# EAGLE design r-2r (EAGLE 7.6.0)

## Sheet 1 of 2
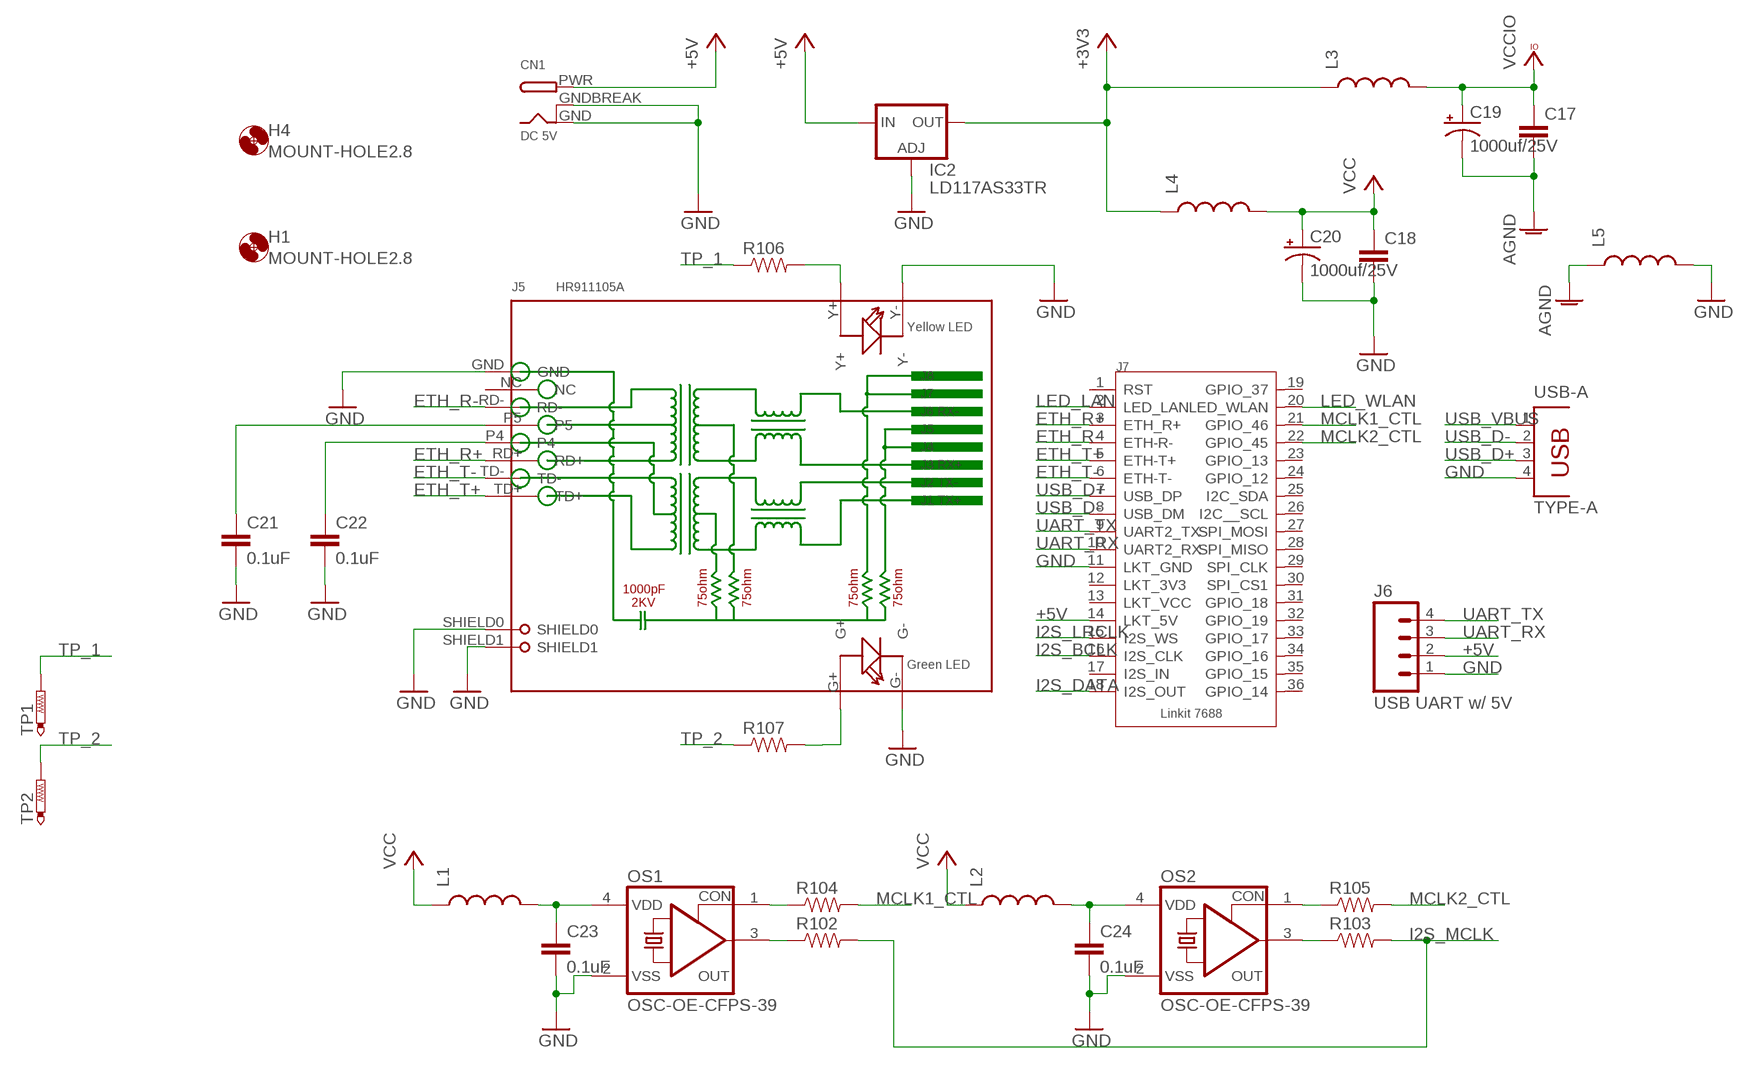
[diagram p0: schematic, sheet 1]

### Parts
C17  CAPPTH1  [CAP-PTH-5MM]
C18  CAPPTH1  [CAP-PTH-5MM]
C19  1000uf/25V  1000UF-25V(PTH)KIT  [CPOL-RADIAL-1000UF-25V-KIT]
C20  1000uf/25V  1000UF-25V(PTH)KIT  [CPOL-RADIAL-1000UF-25V-KIT]
C21  0.1uF  0.1UF-25V(+80/-20%)(0603)  [0603-CAP]
C22  0.1uF  0.1UF-25V(+80/-20%)(0603)  [0603-CAP]
C23  0.1uF  0.1UF-25V(+80/-20%)(0603)  [0603-CAP]
C24  0.1uF  0.1UF-25V(+80/-20%)(0603)  [0603-CAP]
CN1  DC 5V  DCBARRELPTH  [DCJACK_2MM_PTH]
H1  MOUNT-HOLE2.8  [2,8]
H4  MOUNT-HOLE2.8  [2,8]
IC2  LD117AS33TR  [SOT223]
J5  HR911105A  DIP-RJ45-CONNECTOR(HR911105A)  [RJ45-12+2P-21.3X16.04X13.4MM]
J6  USB UART w/ 5V  M04PTH  [1X04]
J7  LINKIT-7688  [LINKIT-7688-2X18]
L1  INDUCTOR0603  [0603]
L2  INDUCTOR0603  [0603]
L3  INDUCTORAXIAL-0.6  [AXIAL-0.6]
L4  INDUCTORAXIAL-0.6  [AXIAL-0.6]
L5  INDUCTOR0603  [0603]
OS1  OSC-OE-CFPS-39  [3.4X2.7-4-PAD]
OS2  OSC-OE-CFPS-39  [3.4X2.7-4-PAD]
R102  RESISTOR0603-RES  [0603-RES]
R103  RESISTOR0603-RES  [0603-RES]
R104  RESISTOR0603-RES  [0603-RES]
R105  RESISTOR0603-RES  [0603-RES]
R106  RESISTOR0603-RES  [0603-RES]
R107  RESISTOR0603-RES  [0603-RES]
TP1  PTR1PAD1-13  [P1-13]
TP2  PTR1PAD1-13  [P1-13]
USB-A  TYPE-A  PN87520  [PN87520]

### Nets
+3V3: IC2.4(OUT) L3.P$1 L4.P$1
+5V: CN1.PWR IC2.3(IN) J6.2 J7.14(LKT_5V)
AGND: C17.2 C19.- L5.1 ; also sheet 2
ETH_R+: J5.RD+ J7.3(ETH_R+)
ETH_R-: J5.RD- J7.4(ETH-R-)
ETH_T+: J5.TD+ J7.5(ETH-T+)
ETH_T-: J5.TD- J7.6(ETH-T-)
GND: C18.2 C20.- C21.2 C22.2 C23.2 C24.2 CN1.GND CN1.GNDBREAK IC2.1(ADJ) J5.G- J5.GND J5.SHIELD0 J5.SHIELD1 J5.Y- J6.1 J7.11(LKT_GND) L5.2 OS1.2(VSS) OS2.2(VSS) USB-A.4 ; also sheet 2
I2S_BCLK: J7.16(I2S_CLK) ; also sheet 2
I2S_DATA: J7.18(I2S_OUT) ; also sheet 2
I2S_LRCLK: J7.15(I2S_WS) ; also sheet 2
I2S_MCLK: R102.2 R103.2 ; also sheet 2
LED_LAN: J7.2(LED_LAN)
LED_WLAN: J7.20(LED_WLAN)
MCLK1_CTL: J7.21(GPIO_46) R104.2
MCLK2_CTL: J7.22(GPIO_45) R105.2
N$16: C24.1 L2.2 OS2.4(VDD)
N$39: OS2.3(OUT) R103.1
N$48: OS1.3(OUT) R102.1
N$55: OS1.1(CON) R104.1
N$56: OS2.1(CON) R105.1
N$57: C23.1 L1.2 OS1.4(VDD)
N$58: J5.G+ R107.2
N$60: J5.Y+ R106.2
N$67: C22.1 J5.P4
N$68: C21.1 J5.P5
TP_1: R106.1 TP1.TP
TP_2: R107.1 TP2.TP
UART_RX: J6.3 J7.10(UART2_RX)
UART_TX: J6.4 J7.9(UART2_TX)
USB_D+: J7.7(USB_DP) USB-A.3
USB_D-: J7.8(USB_DM) USB-A.2
USB_VBUS: USB-A.1
VCC: C18.1 C20.+ L1.1 L2.1 L4.P$2 ; also sheet 2
VCCIO: C17.1 C19.+ L3.P$2 ; also sheet 2
Unconnected: J5.NC J7.1(RST) J7.12(LKT_3V3) J7.13(LKT_VCC) J7.17(I2S_IN) J7.19(GPIO_37) J7.23(GPIO_13) J7.24(GPIO_12) J7.25(I2C_SDA) J7.26(I2C__SCL) J7.27(SPI_MOSI) J7.28(SPI_MISO) J7.29(SPI_CLK) J7.30(SPI_CS1) J7.31(GPIO_18) J7.32(GPIO_19) J7.33(GPIO_17) J7.34(GPIO_16) J7.35(GPIO_15) J7.36(GPIO_14)

## Sheet 2 of 2
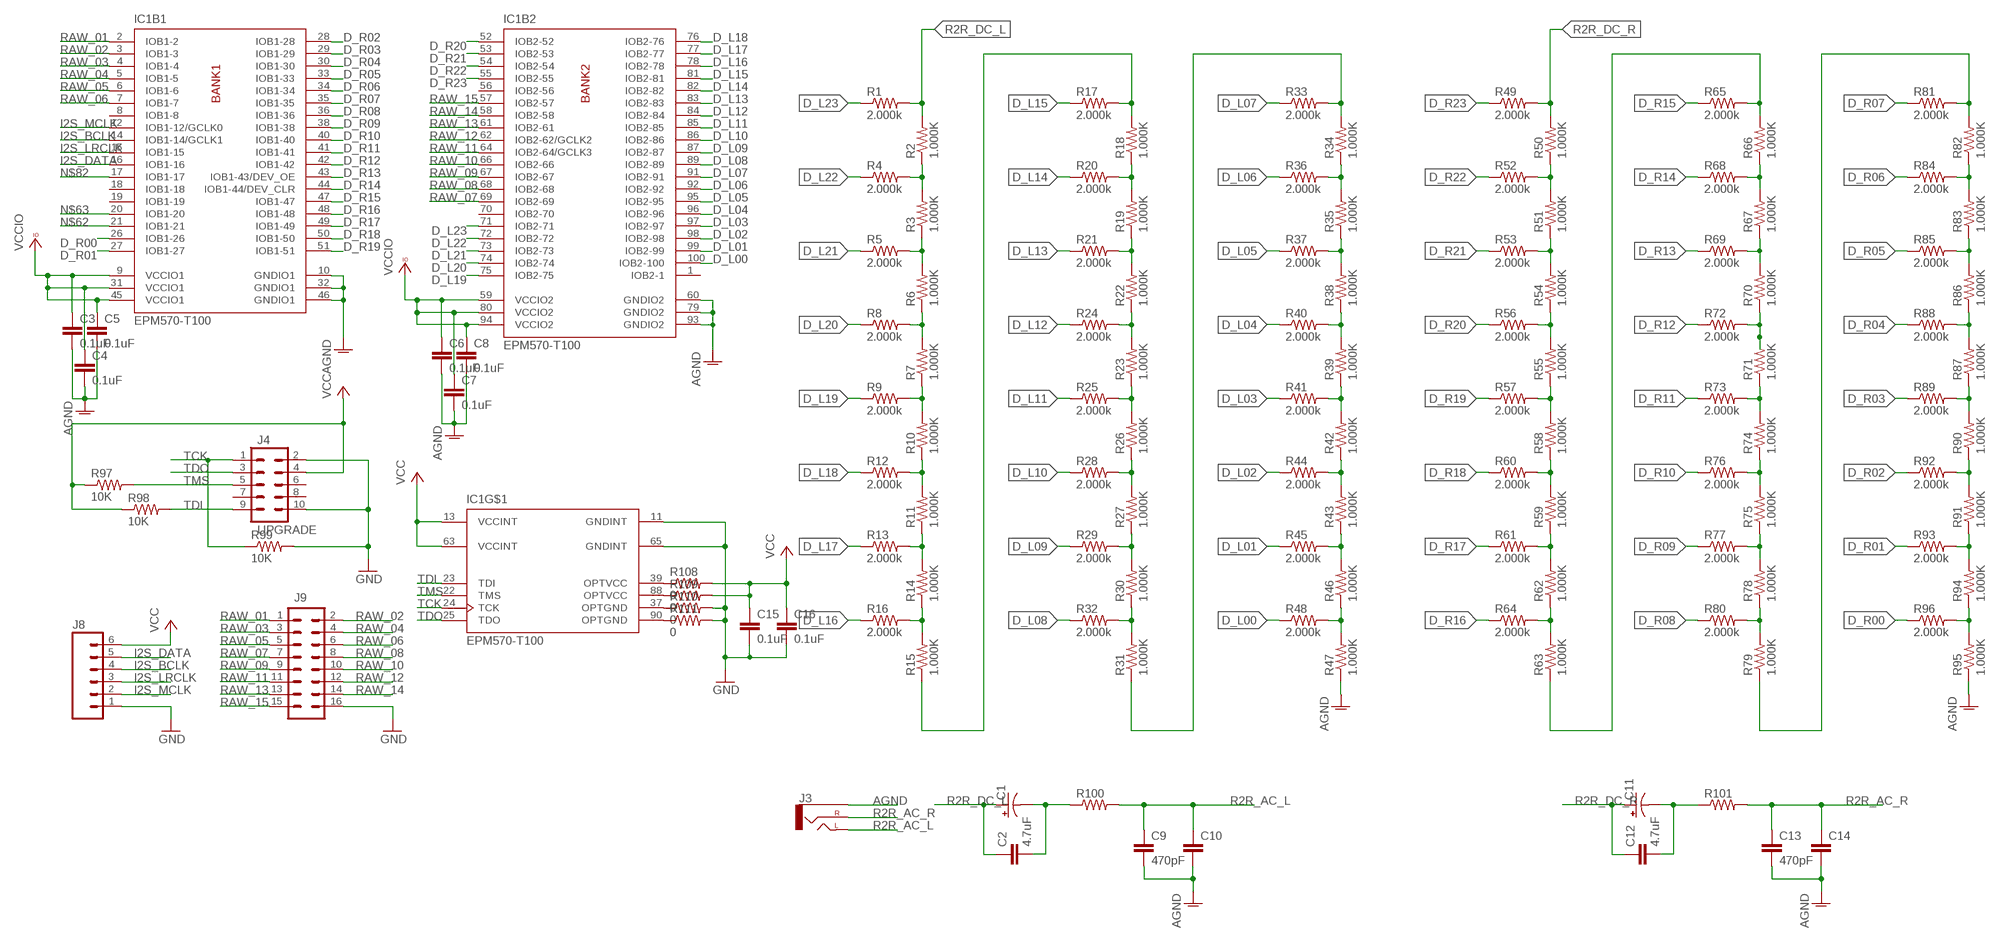
[diagram p1: schematic, sheet 2]

### Parts
C1  10UF-25V-20%(PTH)KIT  [CPOL-RADIAL-10UF-25V-KIT]
C2  4.7uF  4.7UF-16V-20%,+80%-(1206)  [1206-CAP]
C3  0.1uF  0.1UF-25V(+80/-20%)(0603)  [0603-CAP]
C4  0.1uF  0.1UF-25V(+80/-20%)(0603)  [0603-CAP]
C5  0.1uF  0.1UF-25V(+80/-20%)(0603)  [0603-CAP]
C6  0.1uF  0.1UF-25V(+80/-20%)(0603)  [0603-CAP]
C7  0.1uF  0.1UF-25V(+80/-20%)(0603)  [0603-CAP]
C8  0.1uF  0.1UF-25V(+80/-20%)(0603)  [0603-CAP]
C9  470pF  470PF-50V-5%(0603)SMD  [0603-CAP]
C10  CAPPTH1  [CAP-PTH-5MM]
C11  10UF-25V-20%(PTH)KIT  [CPOL-RADIAL-10UF-25V-KIT]
C12  4.7uF  4.7UF-16V-20%,+80%-(1206)  [1206-CAP]
C13  470pF  470PF-50V-5%(0603)SMD  [0603-CAP]
C14  CAPPTH1  [CAP-PTH-5MM]
C15  0.1uF  0.1UF-25V(+80/-20%)(0603)  [0603-CAP]
C16  0.1uF  0.1UF-25V(+80/-20%)(0603)  [0603-CAP]
IC1  EPM570-T100  [TQFP100]
J3  AUDIO-JACKSMD2  [AUDIO-JACK-3.5MM-SMD]
J4  UPGRADE  M05X2SHD  [2X5-SHROUDED]
J8  M06SILK_FEMALE_PTH  [1X06]
J9  M08X2  [2X8]
R1  2.000k  2.0KOHM1/10W5%(0603)  [0603-RES]
R2  1.000K  1KOHM-1/10W-1%(0603)  [0603-RES]
R3  1.000K  1KOHM-1/10W-1%(0603)  [0603-RES]
R4  2.000k  2.0KOHM1/10W5%(0603)  [0603-RES]
R5  2.000k  2.0KOHM1/10W5%(0603)  [0603-RES]
R6  1.000K  1KOHM-1/10W-1%(0603)  [0603-RES]
R7  1.000K  1KOHM-1/10W-1%(0603)  [0603-RES]
R8  2.000k  2.0KOHM1/10W5%(0603)  [0603-RES]
R9  2.000k  2.0KOHM1/10W5%(0603)  [0603-RES]
R10  1.000K  1KOHM-1/10W-1%(0603)  [0603-RES]
R11  1.000K  1KOHM-1/10W-1%(0603)  [0603-RES]
R12  2.000k  2.0KOHM1/10W5%(0603)  [0603-RES]
R13  2.000k  2.0KOHM1/10W5%(0603)  [0603-RES]
R14  1.000K  1KOHM-1/10W-1%(0603)  [0603-RES]
R15  1.000K  1KOHM-1/10W-1%(0603)  [0603-RES]
R16  2.000k  2.0KOHM1/10W5%(0603)  [0603-RES]
R17  2.000k  2.0KOHM1/10W5%(0603)  [0603-RES]
R18  1.000K  1KOHM-1/10W-1%(0603)  [0603-RES]
R19  1.000K  1KOHM-1/10W-1%(0603)  [0603-RES]
R20  2.000k  2.0KOHM1/10W5%(0603)  [0603-RES]
R21  2.000k  2.0KOHM1/10W5%(0603)  [0603-RES]
R22  1.000K  1KOHM-1/10W-1%(0603)  [0603-RES]
R23  1.000K  1KOHM-1/10W-1%(0603)  [0603-RES]
R24  2.000k  2.0KOHM1/10W5%(0603)  [0603-RES]
R25  2.000k  2.0KOHM1/10W5%(0603)  [0603-RES]
R26  1.000K  1KOHM-1/10W-1%(0603)  [0603-RES]
R27  1.000K  1KOHM-1/10W-1%(0603)  [0603-RES]
R28  2.000k  2.0KOHM1/10W5%(0603)  [0603-RES]
R29  2.000k  2.0KOHM1/10W5%(0603)  [0603-RES]
R30  1.000K  1KOHM-1/10W-1%(0603)  [0603-RES]
R31  1.000K  1KOHM-1/10W-1%(0603)  [0603-RES]
R32  2.000k  2.0KOHM1/10W5%(0603)  [0603-RES]
R33  2.000k  2.0KOHM1/10W5%(0603)  [0603-RES]
R34  1.000K  1KOHM-1/10W-1%(0603)  [0603-RES]
R35  1.000K  1KOHM-1/10W-1%(0603)  [0603-RES]
R36  2.000k  2.0KOHM1/10W5%(0603)  [0603-RES]
R37  2.000k  2.0KOHM1/10W5%(0603)  [0603-RES]
R38  1.000K  1KOHM-1/10W-1%(0603)  [0603-RES]
R39  1.000K  1KOHM-1/10W-1%(0603)  [0603-RES]
R40  2.000k  2.0KOHM1/10W5%(0603)  [0603-RES]
R41  2.000k  2.0KOHM1/10W5%(0603)  [0603-RES]
R42  1.000K  1KOHM-1/10W-1%(0603)  [0603-RES]
R43  1.000K  1KOHM-1/10W-1%(0603)  [0603-RES]
R44  2.000k  2.0KOHM1/10W5%(0603)  [0603-RES]
R45  2.000k  2.0KOHM1/10W5%(0603)  [0603-RES]
R46  1.000K  1KOHM-1/10W-1%(0603)  [0603-RES]
R47  1.000K  1KOHM-1/10W-1%(0603)  [0603-RES]
R48  2.000k  2.0KOHM1/10W5%(0603)  [0603-RES]
R49  2.000k  2.0KOHM1/10W5%(0603)  [0603-RES]
R50  1.000K  1KOHM-1/10W-1%(0603)  [0603-RES]
R51  1.000K  1KOHM-1/10W-1%(0603)  [0603-RES]
R52  2.000k  2.0KOHM1/10W5%(0603)  [0603-RES]
R53  2.000k  2.0KOHM1/10W5%(0603)  [0603-RES]
R54  1.000K  1KOHM-1/10W-1%(0603)  [0603-RES]
R55  1.000K  1KOHM-1/10W-1%(0603)  [0603-RES]
R56  2.000k  2.0KOHM1/10W5%(0603)  [0603-RES]
R57  2.000k  2.0KOHM1/10W5%(0603)  [0603-RES]
R58  1.000K  1KOHM-1/10W-1%(0603)  [0603-RES]
R59  1.000K  1KOHM-1/10W-1%(0603)  [0603-RES]
R60  2.000k  2.0KOHM1/10W5%(0603)  [0603-RES]
R61  2.000k  2.0KOHM1/10W5%(0603)  [0603-RES]
R62  1.000K  1KOHM-1/10W-1%(0603)  [0603-RES]
R63  1.000K  1KOHM-1/10W-1%(0603)  [0603-RES]
R64  2.000k  2.0KOHM1/10W5%(0603)  [0603-RES]
R65  2.000k  2.0KOHM1/10W5%(0603)  [0603-RES]
R66  1.000K  1KOHM-1/10W-1%(0603)  [0603-RES]
R67  1.000K  1KOHM-1/10W-1%(0603)  [0603-RES]
R68  2.000k  2.0KOHM1/10W5%(0603)  [0603-RES]
R69  2.000k  2.0KOHM1/10W5%(0603)  [0603-RES]
R70  1.000K  1KOHM-1/10W-1%(0603)  [0603-RES]
R71  1.000K  1KOHM-1/10W-1%(0603)  [0603-RES]
R72  2.000k  2.0KOHM1/10W5%(0603)  [0603-RES]
R73  2.000k  2.0KOHM1/10W5%(0603)  [0603-RES]
R74  1.000K  1KOHM-1/10W-1%(0603)  [0603-RES]
R75  1.000K  1KOHM-1/10W-1%(0603)  [0603-RES]
R76  2.000k  2.0KOHM1/10W5%(0603)  [0603-RES]
R77  2.000k  2.0KOHM1/10W5%(0603)  [0603-RES]
R78  1.000K  1KOHM-1/10W-1%(0603)  [0603-RES]
R79  1.000K  1KOHM-1/10W-1%(0603)  [0603-RES]
R80  2.000k  2.0KOHM1/10W5%(0603)  [0603-RES]
R81  2.000k  2.0KOHM1/10W5%(0603)  [0603-RES]
R82  1.000K  1KOHM-1/10W-1%(0603)  [0603-RES]
R83  1.000K  1KOHM-1/10W-1%(0603)  [0603-RES]
R84  2.000k  2.0KOHM1/10W5%(0603)  [0603-RES]
R85  2.000k  2.0KOHM1/10W5%(0603)  [0603-RES]
R86  1.000K  1KOHM-1/10W-1%(0603)  [0603-RES]
R87  1.000K  1KOHM-1/10W-1%(0603)  [0603-RES]
R88  2.000k  2.0KOHM1/10W5%(0603)  [0603-RES]
R89  2.000k  2.0KOHM1/10W5%(0603)  [0603-RES]
R90  1.000K  1KOHM-1/10W-1%(0603)  [0603-RES]
R91  1.000K  1KOHM-1/10W-1%(0603)  [0603-RES]
R92  2.000k  2.0KOHM1/10W5%(0603)  [0603-RES]
R93  2.000k  2.0KOHM1/10W5%(0603)  [0603-RES]
R94  1.000K  1KOHM-1/10W-1%(0603)  [0603-RES]
R95  1.000K  1KOHM-1/10W-1%(0603)  [0603-RES]
R96  2.000k  2.0KOHM1/10W5%(0603)  [0603-RES]
R97  10K  10OHM-1/10W-5%0603SMD  [0603-RES]
R98  10K  10OHM-1/10W-5%0603SMD  [0603-RES]
R99  10K  10OHM-1/10W-5%0603SMD  [0603-RES]
R100  RESISTOR1206  [1206]
R101  RESISTOR1206  [1206]
R108  0  0OHM-1/10W-5%(0603)  [0603]
R109  0  0OHM-1/10W-5%(0603)  [0603]
R110  0  0OHM-1/10W-5%(0603)  [0603]
R111  0  0OHM-1/10W-5%(0603)  [0603]

### Nets
AGND: C3.2 C4.2 C5.2 C6.2 C7.2 C8.2 C9.2 C10.2 C13.2 C14.2 IC1.10(B1:GNDIO1) IC1.32(B1:GNDIO1) IC1.46(B1:GNDIO1) IC1.60(B2:GNDIO2) IC1.79(B2:GNDIO2) IC1.93(B2:GNDIO2) J3.SLEEVE R47.1 R95.1 ; also sheet 1
D_L00: IC1.100(B2:IOB2-100) R48.1
D_L01: IC1.99(B2:IOB2-99) R45.1
D_L02: IC1.98(B2:IOB2-98) R44.1
D_L03: IC1.97(B2:IOB2-97) R41.1
D_L04: IC1.96(B2:IOB2-96) R40.1
D_L05: IC1.95(B2:IOB2-95) R37.1
D_L06: IC1.92(B2:IOB2-92) R36.1
D_L07: IC1.91(B2:IOB2-91) R33.1
D_L08: IC1.89(B2:IOB2-89) R32.1
D_L09: IC1.87(B2:IOB2-87) R29.1
D_L10: IC1.86(B2:IOB2-86) R28.1
D_L11: IC1.85(B2:IOB2-85) R25.1
D_L12: IC1.84(B2:IOB2-84) R24.1
D_L13: IC1.83(B2:IOB2-83) R21.1
D_L14: IC1.82(B2:IOB2-82) R20.1
D_L15: IC1.81(B2:IOB2-81) R17.1
D_L16: IC1.78(B2:IOB2-78) R16.1
D_L17: IC1.77(B2:IOB2-77) R13.1
D_L18: IC1.76(B2:IOB2-76) R12.1
D_L19: IC1.75(B2:IOB2-75) R9.1
D_L20: IC1.74(B2:IOB2-74) R8.1
D_L21: IC1.73(B2:IOB2-73) R5.1
D_L22: IC1.72(B2:IOB2-72) R4.1
D_L23: IC1.71(B2:IOB2-71) R1.1
D_R00: IC1.26(B1:IOB1-26) R96.1
D_R01: IC1.27(B1:IOB1-27) R93.1
D_R02: IC1.28(B1:IOB1-28) R92.1
D_R03: IC1.29(B1:IOB1-29) R89.1
D_R04: IC1.30(B1:IOB1-30) R88.1
D_R05: IC1.33(B1:IOB1-33) R85.1
D_R06: IC1.34(B1:IOB1-34) R84.1
D_R07: IC1.35(B1:IOB1-35) R81.1
D_R08: IC1.36(B1:IOB1-36) R80.1
D_R09: IC1.38(B1:IOB1-38) R77.1
D_R10: IC1.40(B1:IOB1-40) R76.1
D_R11: IC1.41(B1:IOB1-41) R73.1
D_R12: IC1.42(B1:IOB1-42) R72.1
D_R13: IC1.43(B1:IOB1-43/DEV_OE) R69.1
D_R14: IC1.44(B1:IOB1-44/DEV_CLR) R68.1
D_R15: IC1.47(B1:IOB1-47) R65.1
D_R16: IC1.48(B1:IOB1-48) R64.1
D_R17: IC1.49(B1:IOB1-49) R61.1
D_R18: IC1.50(B1:IOB1-50) R60.1
D_R19: IC1.51(B1:IOB1-51) R57.1
D_R20: IC1.52(B2:IOB2-52) R56.1
D_R21: IC1.53(B2:IOB2-53) R53.1
D_R22: IC1.54(B2:IOB2-54) R52.1
D_R23: IC1.55(B2:IOB2-55) R49.1
GND: C15.2 C16.2 IC1.11(GNDINT) IC1.65(GNDINT) J4.2 J4.10 J8.1 J9.16 R99.2 R110.2 R111.2 ; also sheet 1
I2S_BCLK: IC1.14(B1:IOB1-14/GCLK1) J8.4 ; also sheet 1
I2S_DATA: IC1.16(B1:IOB1-16) J8.5 ; also sheet 1
I2S_LRCLK: IC1.15(B1:IOB1-15) J8.3 ; also sheet 1
I2S_MCLK: IC1.12(B1:IOB1-12/GCLK0) J8.2 ; also sheet 1
N$1: R7.1 R9.2 R10.2
N$2: R2.1 R3.2 R4.2
N$3: R3.1 R5.2 R6.2
N$4: R6.1 R7.2 R8.2
N$5: C1.2(-) C2.2 R100.1
N$6: R10.1 R11.2 R12.2
N$7: R11.1 R13.2 R14.2
N$8: R14.1 R15.2 R16.2
N$9: R15.1 R17.2 R18.2
N$10: R31.1 R33.2 R34.2
N$11: R79.1 R81.2 R82.2
N$12: R63.1 R65.2 R66.2
N$13: IC1.39(OPTVCC) R108.1
N$14: R18.1 R19.2 R20.2
N$15: R19.1 R21.2 R22.2
N$17: R46.1 R47.2 R48.2
N$18: R43.1 R45.2 R46.2
N$19: R34.1 R35.2 R36.2
N$20: R35.1 R37.2 R38.2
N$21: R38.1 R39.2 R40.2
N$22: R39.1 R41.2 R42.2
N$23: R42.1 R43.2 R44.2
N$24: R66.1 R67.2 R68.2
N$25: R67.1 R69.2 R70.2
N$26: R70.1 R71.2 R72.2
N$27: R71.1 R73.2 R74.2
N$28: R74.1 R75.2 R76.2
N$29: R75.1 R77.2 R78.2
N$30: R78.1 R79.2 R80.2
N$31: R82.1 R83.2 R84.2
N$32: R83.1 R85.2 R86.2
N$33: R86.1 R87.2 R88.2
N$34: R87.1 R89.2 R90.2
N$35: R90.1 R91.2 R92.2
N$36: R91.1 R93.2 R94.2
N$37: R94.1 R95.2 R96.2
N$38: C11.2(-) C12.2 R101.1
N$40: R22.1 R23.2 R24.2
N$41: R23.1 R25.2 R26.2
N$42: R26.1 R27.2 R28.2
N$43: R27.1 R29.2 R30.2
N$44: R30.1 R31.2 R32.2
N$45: R50.1 R51.2 R52.2
N$46: R51.1 R53.2 R54.2
N$47: R54.1 R55.2 R56.2
N$49: R55.1 R57.2 R58.2
N$50: R58.1 R59.2 R60.2
N$51: R59.1 R61.2 R62.2
N$52: R62.1 R63.2 R64.2
N$53: IC1.88(OPTVCC) R109.1
N$59: IC1.37(OPTGND) R110.1
N$61: IC1.90(OPTGND) R111.1
N$62: IC1.21(B1:IOB1-21)
N$63: IC1.20(B1:IOB1-20)
N$82: IC1.17(B1:IOB1-17)
R2R_AC_L: C9.1 C10.1 J3.TIP(LEFT) R100.2
R2R_AC_R: C13.1 C14.1 J3.RING(RIGHT) R101.2
R2R_DC_L: C1.1(+) C2.1 R1.2 R2.2
R2R_DC_R: C11.1(+) C12.1 R49.2 R50.2
RAW_01: IC1.2(B1:IOB1-2) J9.1
RAW_02: IC1.3(B1:IOB1-3) J9.2
RAW_03: IC1.4(B1:IOB1-4) J9.3
RAW_04: IC1.5(B1:IOB1-5) J9.4
RAW_05: IC1.6(B1:IOB1-6) J9.5
RAW_06: IC1.7(B1:IOB1-7) J9.6
RAW_07: IC1.69(B2:IOB2-69) J9.7
RAW_08: IC1.68(B2:IOB2-68) J9.8
RAW_09: IC1.67(B2:IOB2-67) J9.9
RAW_10: IC1.66(B2:IOB2-66) J9.10
RAW_11: IC1.64(B2:IOB2-64/GCLK3) J9.11
RAW_12: IC1.62(B2:IOB2-62/GCLK2) J9.12
RAW_13: IC1.61(B2:IOB2-61) J9.13
RAW_14: IC1.58(B2:IOB2-58) J9.14
RAW_15: IC1.57(B2:IOB2-57) J9.15
TCK: IC1.24(TCK) J4.1 R99.1
TDI: IC1.23(TDI) J4.9 R98.2
TDO: IC1.25(TDO) J4.3
TMS: IC1.22(TMS) J4.5 R97.2
VCC: C15.1 C16.1 IC1.13(VCCINT) IC1.63(VCCINT) J4.4 J8.6 R97.1 R98.1 R108.2 R109.2 ; also sheet 1
VCCIO: C3.1 C4.1 C5.1 C6.1 C7.1 C8.1 IC1.9(B1:VCCIO1) IC1.31(B1:VCCIO1) IC1.45(B1:VCCIO1) IC1.59(B2:VCCIO2) IC1.80(B2:VCCIO2) IC1.94(B2:VCCIO2) ; also sheet 1
Unconnected: IC1.1(B2:IOB2-1) IC1.8(B1:IOB1-8) IC1.18(B1:IOB1-18) IC1.19(B1:IOB1-19) IC1.56(B2:IOB2-56) IC1.70(B2:IOB2-70) J4.6 J4.7 J4.8

## Library data of the parts
C1 C11 = SparkFun-Capacitors:10UF-25V-20%(PTH): CAP-08440; PROD_ID: CAP-08440
C2 C12 = SparkFun-Capacitors:4.7UF-16V-20%,+80%-(1206): CAP-10300; PROD_ID: CAP-10300
C3-C8 C15 C16 C21-C24 = SparkFun-Capacitors:0.1UF-25V(+80/-20%)(0603): CAP-00810 Ceramic Standard decoupling cap; PROD_ID: CAP-00810
C9 C13 = SparkFun-Capacitors:470PF-50V-5%(0603): CAP-07884; PROD_ID: CAP-07884
C10 C14 C17 C18 = SparkFun-Capacitors:CAP: Capacitor Standard 0603 ceramic capacitor, and 0.1" leaded capacitor.
C19 C20 = SparkFun-Capacitors:1000UF-25V(PTH): CAP-08070; PROD_ID: CAP-09538
CN1 = adafruit:DCBARREL: 2.0mm DC Barrel Jack DCJACK_2MM_PTH - Through Hole Jack (4UConnector: 05537)
H1 H4 = holes:MOUNT-HOLE: MOUNTING HOLE with drill center marker
IC1 = noel-altera-max2:EPM570-T100: Altera MAX II CPLD - EPM570 TQFP-100 Device EPM570 from Altera MAX II Family Feature EPM570 LEs 570 Typical Equivalent Macrocells 440 Equivalent Macrocell Range 240 ... 570 UFM Size (bits) 8192 User I/O pins 76 tPD1 (ns) 5.4 fCNT (MHz) 304 tSU (ns) 1.2 tCO (ns) 4.5
IC2 = v-reg:LD117A?*: Low drop fixed and adjustable positive voltage regulators 1 A Source: http://www.st.com/stonline/products/literature/ds/7194/ld1117axx.pdf
J3 = SparkFun-Connectors:AUDIO-JACK: 3.5mm Audio Jack Simple 3.5mm common PCB mount audio jack. Variant PTH is our storefront SKU PRT-08032; PROD_ID: CONN-10353
J4 = SparkFun-Connectors:M05X2: Header 5x2 Standard 10-pin dual row 0.1" header. Commonly used with AVR-ISP. Use with Spark Fun Electronics SKU: PRT-00778
J5 = Seeed-OPL-Connector:DIP-RJ45-CONNECTOR(HR911105A): 320140005; MPN: HR911105A
J6 = SparkFun-Connectors:M04: Header 4 Standard 4-pin 0.1" header. Use with straight break away headers (SKU : PRT-00116), right angle break away headers (PRT-00553), swiss pins (PRT-00743), machine pins (PRT-00117), and female headers (PRT-00115). Molex polarized connector foot print use with SKU : PRT-08231 with associated crimp pins and housings. 1MM SMD Version SKU: PRT-10208; PROD_ID: CONN-09696
J7 = linkit7688:LINKIT-7688
J8 = SparkFun-Connectors:M06: Header 6 Standard 6-pin 0.1" header. Use with straight break away headers (SKU : PRT-00116), right angle break away headers (PRT-00553), swiss pins (PRT-00743), machine pins (PRT-00117), and female headers (PRT-00115). Molex polarized connector foot print use with SKU : PRT-08094 with associated crimp pins and housings. NOTES ON THE VARIANTS LOCK and LOCK_LONGPADS... This footprint was designed to help hold the alignment of a through-hole component (i.e. 6-pin header) while soldering it into place. You may notice that each hole has been shifted either up or down by 0.005 of an inch from it's more standard position (which is a perfectly straight line). This slight alteration caused the pins (the squares in the middle) to touch the edges of the holes. Because they are alternating, it causes a "brace" to hold the component in place. 0.005 has proven to be the perfect amount of "off-center" position when using our standard breakaway headers. Although looks a little odd when you look at the bare footprint, once you have a header in there, the alteration is very hard to notice. Also,if you push a header all the way into place, it is covered up entirely on the bottom side. This idea of altering the position of holes to aid alignment will be further integrated into the Sparkfun Library for other footprints. It can help hold any component with 3 or more connection pins.; PROD_ID: CONN-08437
J9 = SparkFun-Connectors:M08X2: .1" headers, two rows of 8 each
L1-L5 = SparkFun-Passives:INDUCTOR: Inductors Basic Inductor/Choke - 0603 and 1206. Footprints are not proven and vary greatly between part numbers. INDUCTOR POWER 3.3UH 4.0A SMD 0.197" L x 0.197" W x 0.177" H (5.00mm x 5.00mm x 4.50mm)
OS1 OS2 = IQD-Frequency-Products:OSC-OE: OSCILLATOR WITH OE
R1 R4 R5 R8 R9 R12 R13 R16 R17 R20 R21 R24 R25 R28 R29 R32 R33 R36 R37 R40 R41 R44 R45 R48 R49 R52 R53 R56 R57 R60 R61 R64 R65 R68 R69 R72 R73 R76 R77 R80 R81 R84 R85 R88 R89 R92 R93 R96 = SparkFun-Resistors:2.0KOHM1/10W5%(0603): RES-08296; PROD_ID: RES-08296; VALUE: 2.0k
R2 R3 R6 R7 R10 R11 R14 R15 R18 R19 R22 R23 R26 R27 R30 R31 R34 R35 R38 R39 R42 R43 R46 R47 R50 R51 R54 R55 R58 R59 R62 R63 R66 R67 R70 R71 R74 R75 R78 R79 R82 R83 R86 R87 R90 R91 R94 R95 = SparkFun-Resistors:1KOHM-1/10W-1%(0603): RES-07856; PROD_ID: RES-07856; VALUE: 1K
R97-R99 = SparkFun-Resistors:10OHM-1/10W-5%0603: RES-09834; PROD_ID: RES-09834; VALUE: 10
R100 R101 = SparkFun-Resistors:RESISTOR: Resistor Basic schematic elements and footprints for 0603, 1206, and PTH resistors.
R102-R107 = SparkFun-Passives:RESISTOR: Resistor Basic schematic elements and footprints for 0603, 1206, and PTH resistors.
R108-R111 = SparkFun-Resistors:0OHM-1/10W-5%(0603): RES-08609; PROD_ID: RES-08609
TP1 TP2 = testpad:PTR1: TEST PIN
USB-A = con-berg:PN87520: BERG USB connector; OC_FARNELL: unknown; OC_NEWARK: unknown

## Board
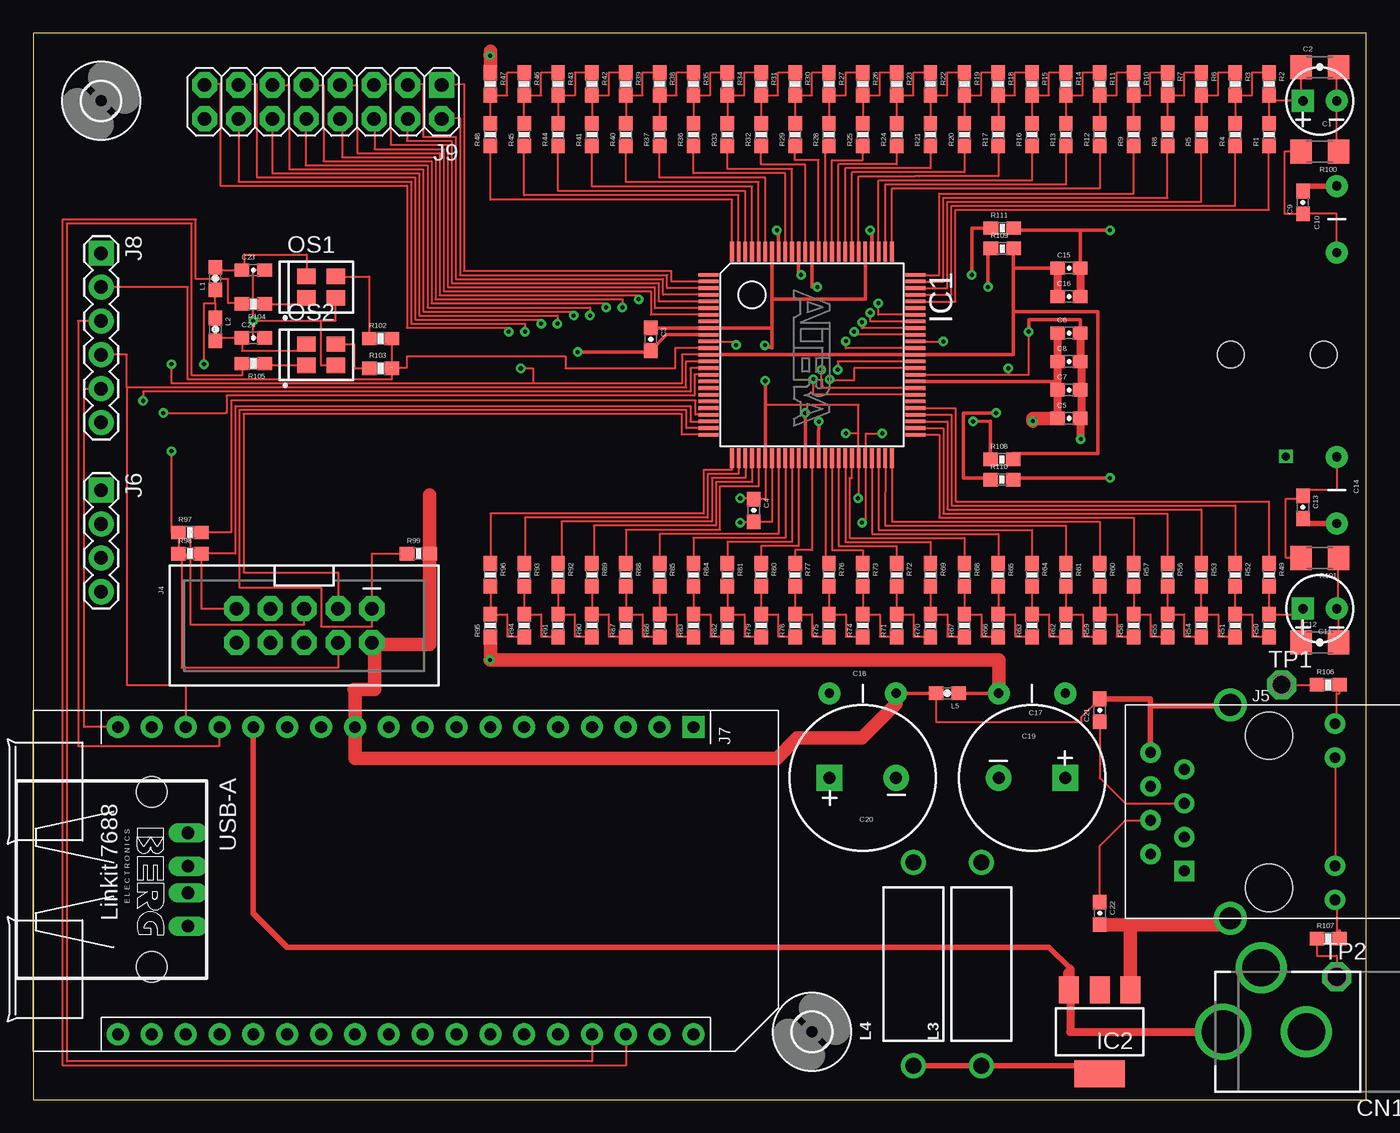
[diagram p2: board, top side]
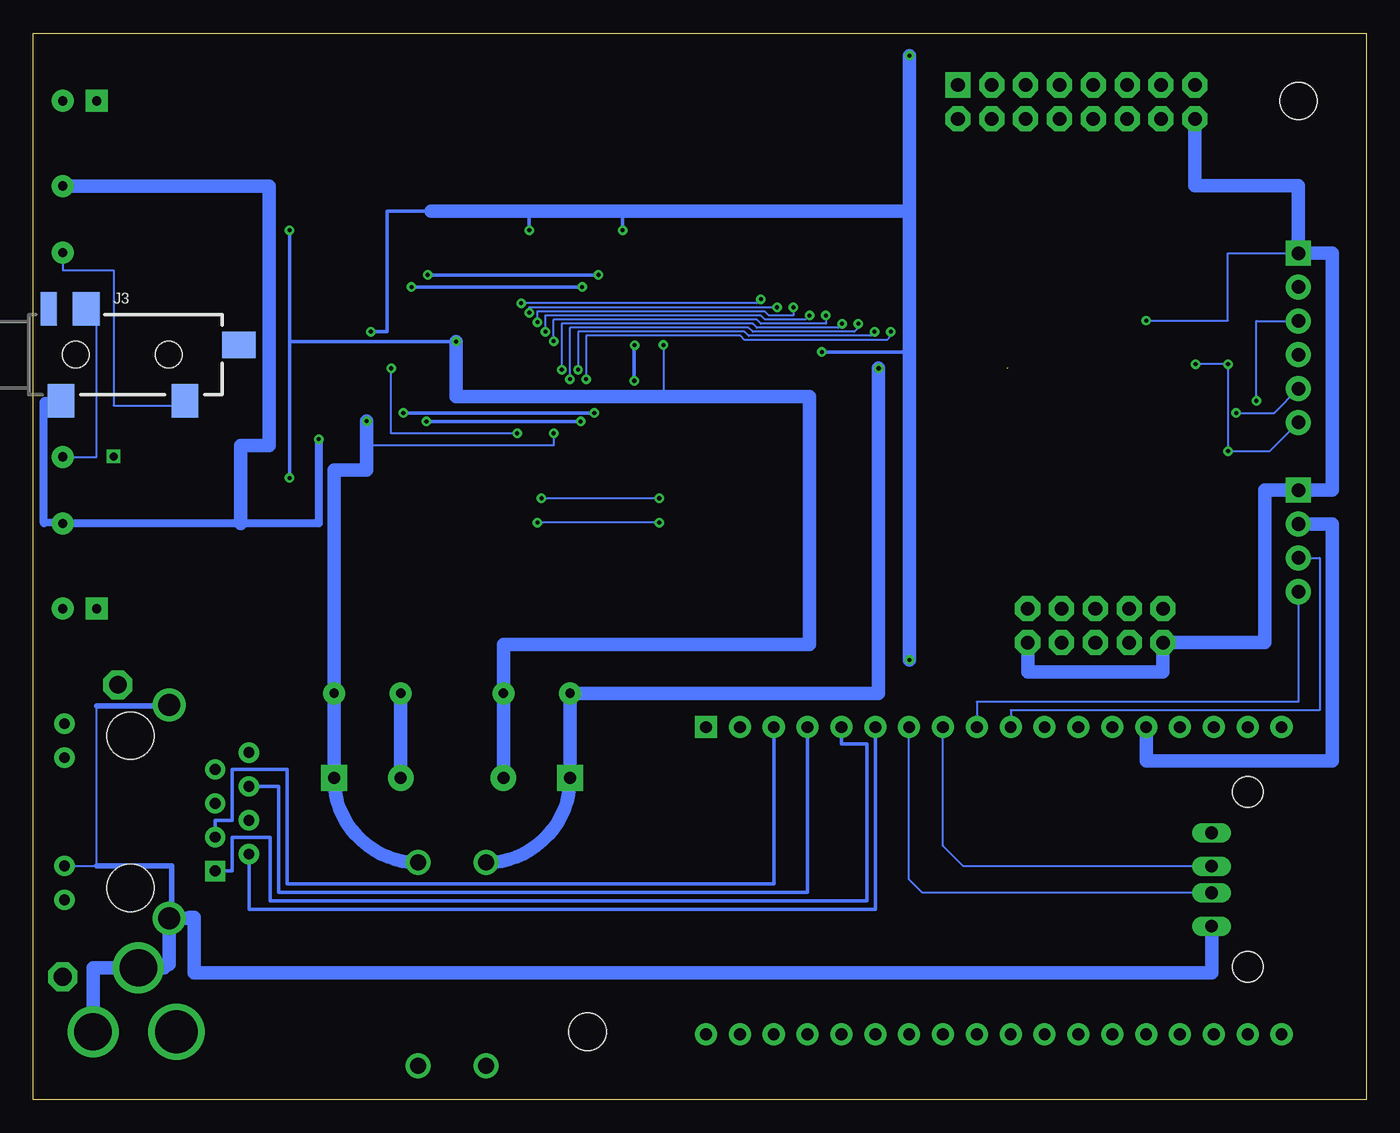
[diagram p3: board, bottom side, seen from below]

Size 100 x 80 mm. Coordinates in mm from the lower left corner, seen from the top.
Outline: 0,0 100,0 100,80 0,80 0,0
Copper layers (1*16): Top 0.035mm / dielectric 1.5mm / Bottom 0.035mm
Design rules "default *": minimum track width 6mil, minimum drill 12mil, track to track 6mil, track to pad 6mil, pad to pad 6mil, via to via 6mil, smd to smd 6mil, copper to edge 40mil, drill to drill 8mil, minimum pad ring 10mil, minimum via ring 8mil, stop-mask expansion 4mil, vias tented up to drill 0mil, thermal gap 10mil

### Footprints (pad centres in the part's own frame; a part is rotated, then mirrored left to right if it is on the bottom)
CPOL-RADIAL-10UF-25V-KIT = drill 0.7 pad 1.651 square: 1 1.27,0 | drill 0.7 pad 1.651: 2 -1.27,0
1206-CAP = smd 1.6 x 1.8: 1 -1.4,0; 2 1.4,0
0603-CAP = smd 1.1 x 1: 1 -0.85,0; 2 0.85,0
CAP-PTH-5MM = drill 0.7 pad 1.651: 1 -2.5,0; 2 2.5,0
CPOL-RADIAL-1000UF-25V-KIT = drill 0.9 pad 1.93 square: + 2.5,0 | drill 0.9 pad 1.93: - -2.5,0
DCJACK_2MM_PTH = drill 2.8: GND 0,7.35; GNDBREAK 4.8,10.75 | drill 3.2: PWR 0,13.6
2,8 = hole 2.8: 0,0
TQFP100 = smd 0.27 x 1.5: 1 -6,-7.75; 2 -5.5,-7.75; 3 -5,-7.75; 4 -4.5,-7.75; 5 -4,-7.75; 6 -3.5,-7.75; 7 -3,-7.75; 8 -2.5,-7.75; 9 -2,-7.75; 10 -1.5,-7.75; 11 -1,-7.75; 12 -0.5,-7.75; 13 0,-7.75; 14 0.5,-7.75; 15 1,-7.75; 16 1.5,-7.75; 17 2,-7.75; 18 2.5,-7.75; 19 3,-7.75; 20 3.5,-7.75; 21 4,-7.75; 22 4.5,-7.75; 23 5,-7.75; 24 5.5,-7.75; 25 6,-7.75; 51 6,7.75; 52 5.5,7.75; 53 5,7.75; 54 4.5,7.75; 55 4,7.75; 56 3.5,7.75; 57 3,7.75; 58 2.5,7.75; 59 2,7.75; 60 1.5,7.75; 61 1,7.75; 62 0.5,7.75; 63 0,7.75; 64 -0.5,7.75; 65 -1,7.75; 66 -1.5,7.75; 67 -2,7.75; 68 -2.5,7.75; 69 -3,7.75; 70 -3.5,7.75; 71 -4,7.75; 72 -4.5,7.75; 73 -5,7.75; 74 -5.5,7.75; 75 -6,7.75 | smd 1.5 x 0.27: 26 7.75,-6; 27 7.75,-5.5; 28 7.75,-5; 29 7.75,-4.5; 30 7.75,-4; 31 7.75,-3.5; 32 7.75,-3; 33 7.75,-2.5; 34 7.75,-2; 35 7.75,-1.5; 36 7.75,-1; 37 7.75,-0.5; 38 7.75,0; 39 7.75,0.5; 40 7.75,1; 41 7.75,1.5; 42 7.75,2; 43 7.75,2.5; 44 7.75,3; 45 7.75,3.5; 46 7.75,4; 47 7.75,4.5; 48 7.75,5; 49 7.75,5.5; 50 7.75,6; 76 -7.75,6; 77 -7.75,5.5; 78 -7.75,5; 79 -7.75,4.5; 80 -7.75,4; 81 -7.75,3.5; 82 -7.75,3; 83 -7.75,2.5; 84 -7.75,2; 85 -7.75,1.5; 86 -7.75,1; 87 -7.75,0.5; 88 -7.75,0; 89 -7.75,-0.5; 90 -7.75,-1; 91 -7.75,-1.5; 92 -7.75,-2; 93 -7.75,-2.5; 94 -7.75,-3; 95 -7.75,-3.5; 96 -7.75,-4; 97 -7.75,-4.5; 98 -7.75,-5; 99 -7.75,-5.5; 100 -7.75,-6
SOT223 = smd 1.5 x 2: 1 -2.3,-3.15; 2 0,-3.15; 3 2.3,-3.15 | smd 3.8 x 2: 4 0,3.15
AUDIO-JACK-3.5MM-SMD = smd 2 x 2.5: RING 4.3,3.45; SLEEVE 2.4,-3.45; TIP 11.7,-3.45 | smd 1.2 x 2.5: RSH 1.5,3.45 | smd 2.5 x 2: TSH 15.75,0.75 | hole 2: 3.5,0; 10.5,0
2X5-SHROUDED = drill 1.016 pad 1.88 octagon: 1 -1.27,5.08; 2 1.27,5.08; 3 -1.27,2.54; 4 1.27,2.54; 5 -1.27,0; 6 1.27,0; 7 -1.27,-2.54; 8 1.27,-2.54; 9 -1.27,-5.08; 10 1.27,-5.08
RJ45-12+2P-21.3X16.04X13.4MM = drill 0.813 pad 1.524: G+ 4.953,-6.604; G- 4.953,-4.064; GND -8.89,4.445; NC -6.35,3.175; P4 -8.89,-0.635; P5 -6.35,0.635; RD+ -6.35,-1.905; RD- -8.89,1.905; TD- -8.89,-3.175; Y+ 4.953,6.604; Y- 4.953,4.064 | drill 1.651 pad 2.159: SHIELD0 -2.921,8.001; SHIELD1 -2.921,-8.001 | drill 0.813 pad 1.524 square: TD+ -6.35,-4.445 | hole 3.556: 0,-5.715; 0,5.715
1X04 = drill 1.016 pad 1.88 square: 1 0,0 | drill 1.016 pad 1.88: 2 2.54,0; 3 5.08,0; 4 7.62,0
LINKIT-7688-2X18 = drill 0.889 pad 1.651 square: 1 0,19.05 | drill 0.889 pad 1.651: 2 0,16.51; 3 0,13.97; 4 0,11.43; 5 0,8.89; 6 0,6.35; 7 0,3.81; 8 0,1.27; 9 0,-1.27; 10 0,-3.81; 11 0,-6.35; 12 0,-8.89; 13 0,-11.43; 14 0,-13.97; 15 0,-16.51; 16 0,-19.05; 17 0,-21.59; 18 0,-24.13; 19 23.05,19.05; 20 23.05,16.51; 21 23.05,13.97; 22 23.05,11.43; 23 23.05,8.89; 24 23.05,6.35; 25 23.05,3.81; 26 23.05,1.27; 27 23.05,-1.27; 28 23.05,-3.81; 29 23.05,-6.35; 30 23.05,-8.89; 31 23.05,-11.43; 32 23.05,-13.97; 33 23.05,-16.51; 34 23.05,-19.05; 35 23.05,-21.59; 36 23.05,-24.13
1X06 = drill 1.016 pad 1.88 square: 1 0,0 | drill 1.016 pad 1.88: 2 2.54,0; 3 5.08,0; 4 7.62,0; 5 10.16,0; 6 12.7,0
2X8 = drill 1.016 pad 1.88 square: 1 0,0 | drill 1.016 pad 1.88 octagon: 2 0,2.54; 3 2.54,0; 4 2.54,2.54; 5 5.08,0; 6 5.08,2.54; 7 7.62,0; 8 7.62,2.54; 9 10.16,0; 10 10.16,2.54; 11 12.7,0; 12 12.7,2.54; 13 15.24,0; 14 15.24,2.54; 15 17.78,0; 16 17.78,2.54
0603 = smd 1.1 x 1: 1 -0.85,0; 2 0.85,0
AXIAL-0.6 = drill 1.2 pad 1.88: P$1 -7.62,0; P$2 7.62,0
3.4X2.7-4-PAD = smd 1.4 x 1.15: 1 -1.1,-0.8; 2 1.1,-0.8; 3 1.1,0.8; 4 -1.1,0.8
0603-RES = smd 1.1 x 1: 1 -0.85,0; 2 0.85,0
1206 = smd 1.6 x 1.8: 1 -1.4,0; 2 1.4,0
P1-13 = drill 1.321 pad 2.159 octagon: TP 0,0
PN87520 = drill 0.95 long: 1 -3.5,2.71; 2 -1,2.71; 3 1,2.71; 4 3.5,2.71 | hole 2.3: -6.57,0; 6.57,0

### Placement (x,y rotation side)
C1  96.52,74.93 180 top
C2  96.52,77.47 0 top
C3  46.33,57.05 270 top
C4  54.05,44.2 270 top
C5  77.7,51.1 0 top
C6  77.7,57.51 0 top
C7  77.7,53.24 0 top
C8  77.7,55.37 0 top
C9  95.25,67.31 90 top
C10  97.79,66.04 90 top
C11  96.52,36.83 180 top
C12  96.52,34.29 0 top
C13  95.25,44.45 270 top
C14  97.79,45.72 270 top
C15  77.7,62.38 0 top
C16  77.7,60.25 0 top
C17  74.93,30.48 180 top
C18  62.23,30.48 0 top
C19  74.93,24.13 0 top
C20  62.23,24.13 180 top
C21  80.01,29.21 90 top
C22  80.01,13.97 270 top
C23  16.51,62.23 0 top
C24  16.51,57.15 0 top
CN1  102.87,5.08 90 top
H1  5.08,74.93 0 top
H4  58.42,5.08 0 top
IC1  58.42,55.88 270 top
IC2  80.01,5.08 180 top
J3  100.33,55.88 0 bottom
J4  20.32,35.56 270 top
J5  92.71,21.59 0 top
J6  5.08,45.72 270 top
J7  30.48,27.94 270 top
J8  5.08,63.5 270 top
J9  30.63,76.12 180 top
L1  13.65,61.59 90 top
L2  13.65,57.78 270 top
L3  71.12,10.16 90 top
L4  66.04,10.16 90 top
L5  68.58,30.48 180 top
OS1  21.59,60.96 0 top
OS2  21.59,55.88 0 top
R1  92.71,72.39 90 top
R2  92.71,76.2 270 top
R3  90.17,76.2 270 top
R4  90.17,72.39 90 top
R5  87.63,72.39 90 top
R6  87.63,76.2 270 top
R7  85.09,76.2 270 top
R8  85.09,72.39 90 top
R9  82.55,72.39 90 top
R10  82.55,76.2 270 top
R11  80.01,76.2 270 top
R12  80.01,72.39 90 top
R13  77.47,72.39 90 top
R14  77.47,76.2 270 top
R15  74.93,76.2 270 top
R16  74.93,72.39 90 top
R17  72.39,72.39 90 top
R18  72.39,76.2 270 top
R19  69.85,76.2 270 top
R20  69.85,72.39 90 top
R21  67.31,72.39 90 top
R22  67.31,76.2 270 top
R23  64.77,76.2 270 top
R24  64.77,72.39 90 top
R25  62.23,72.39 90 top
R26  62.23,76.2 270 top
R27  59.69,76.2 270 top
R28  59.69,72.39 90 top
R29  57.15,72.39 90 top
R30  57.15,76.2 270 top
R31  54.61,76.2 270 top
R32  54.61,72.39 90 top
R33  52.07,72.39 90 top
R34  52.07,76.2 270 top
R35  49.53,76.2 270 top
R36  49.53,72.39 90 top
R37  46.99,72.39 90 top
R38  46.99,76.2 270 top
R39  44.45,76.2 270 top
R40  44.45,72.39 90 top
R41  41.91,72.39 90 top
R42  41.91,76.2 270 top
R43  39.37,76.2 270 top
R44  39.37,72.39 90 top
R45  36.83,72.39 90 top
R46  36.83,76.2 270 top
R47  34.29,76.2 270 top
R48  34.29,72.39 90 top
R49  92.71,39.37 270 top
R50  92.71,35.56 90 top
R51  90.17,35.56 90 top
R52  90.17,39.37 270 top
R53  87.63,39.37 270 top
R54  87.63,35.56 90 top
R55  85.09,35.56 90 top
R56  85.09,39.37 270 top
R57  82.55,39.37 270 top
R58  82.55,35.56 90 top
R59  80.01,35.56 90 top
R60  80.01,39.37 270 top
R61  77.47,39.37 270 top
R62  77.47,35.56 90 top
R63  74.93,35.56 90 top
R64  74.93,39.37 270 top
R65  72.39,39.37 270 top
R66  72.39,35.56 90 top
R67  69.85,35.56 90 top
R68  69.85,39.37 270 top
R69  67.31,39.37 270 top
R70  67.31,35.56 90 top
R71  64.77,35.56 90 top
R72  64.77,39.37 270 top
R73  62.23,39.37 270 top
R74  62.23,35.56 90 top
R75  59.69,35.56 90 top
R76  59.69,39.37 270 top
R77  57.15,39.37 270 top
R78  57.15,35.56 90 top
R79  54.61,35.56 90 top
R80  54.61,39.37 270 top
R81  52.07,39.37 270 top
R82  52.07,35.56 90 top
R83  49.53,35.56 90 top
R84  49.53,39.37 270 top
R85  46.99,39.37 270 top
R86  46.99,35.56 90 top
R87  44.45,35.56 90 top
R88  44.45,39.37 270 top
R89  41.91,39.37 270 top
R90  41.91,35.56 90 top
R91  39.37,35.56 90 top
R92  39.37,39.37 270 top
R93  36.83,39.37 270 top
R94  36.83,35.56 90 top
R95  34.29,35.56 90 top
R96  34.29,39.37 270 top
R97  11.75,42.55 0 top
R98  11.75,40.96 0 top
R99  28.89,40.96 0 top
R100  96.52,71.12 180 top
R101  96.52,40.64 180 top
R102  26.06,57.1 0 top
R103  26.06,54.86 0 top
R104  16.51,59.69 180 top
R105  16.51,55.22 180 top
R106  97.16,31.11 0 top
R107  97.16,12.06 0 top
R108  72.67,48.03 0 top
R109  72.69,63.86 0 top
R110  72.67,46.51 0 top
R111  72.69,65.38 0 top
TP1  93.66,31.11 0 top
TP2  97.79,9.21 0 top
USB-A  8.89,16.51 270 top

### Tracks (layer width: path | path; a pad name or v marks a point on that pad's centre or on a via)
+3V3
  Top 0.406: L4.P$1 L3.P$1 79.4,2.54 IC2.4
+5V
  Top 0.406: IC2.3 77.47,8.47 77.47,9.53 77.79,9.84 76.2,11.43 19.05,11.43 16.51,13.97 J7.14
  Top 0.61: 77.79,9.84 77.79,5.08 CN1.PWR
  Bottom 1.016: J6.2 2.54,43.18 2.54,25.4 16.51,25.4 J7.14
AGND  (via drill 0.3)
  Top 0.152: IC1.32 55.42,43.35 C4.2 arc-90 53.99,43.28 v53.03,43.28 | v62.18,43.28 62.48,43.59 62.48,48.13 | 62.48,48.13 IC1.46 | IC1.60 73.15,54.38 | 73.15,54.38 74.68,54.38 v74.68,57.61 | 62.48,48.13 62.48,49.99 v63.7,49.99 | v73.15,54.86 73.15,54.38
  Top 0.254: L5.1 C17.2 | IC1.10 47.51,57.38 C3.2 46.33,56.08 v40.84,56.08 | IC1.93 55.92,65.23 v55.78,65.23 | IC1.79 62.92,65.23 v62.79,65.23 | v74.68,57.61 74.68,58.52 78.55,58.52 C6.2
  Top 0.406: C10.2 95.25,68.54 C9.2 | C14.2 95.25,43.22 C13.2
  Top 0.61: C6.2 C8.2 78.55,55.17 78.64,55.17 78.64,53.24 C7.2 78.55,53.03 78.64,53.03 78.64,51.1 C5.2 78.55,49.55 v78.59,49.55
  Top 1.016: R95.1 34.29,32.99 v34.27,32.99 72.43,32.99 C17.2 | R47.1 34.29,78.64 v34.27,78.33
  Bottom 0.152: v53.03,43.28 v62.18,43.28 | v63.7,49.99 73.15,49.99 v73.15,54.86
  Bottom 0.254: v55.78,65.23 55.78,66.65 | v62.79,65.23 62.79,66.65 | v40.84,56.08 34.27,56.08 | 70.16,66.65 73.46,66.65 73.46,57.61 v74.68,57.61
  Bottom 0.61: v78.59,49.55 78.59,43.22 84.43,43.22 C14.2 97.79,43.28 99.21,43.26 99.21,52.41 J3.SLEEVE
  Bottom 1.016: C19.- C17.2 72.42,30.48 | v34.27,32.99 34.27,56.08 34.27,66.65 | 34.27,66.65 v34.27,78.33 | 34.27,66.65 55.78,66.65 62.79,66.65 70.16,66.65 | C10.2 82.3,68.54 82.3,49.07 84.43,49.07 84.43,43.22
D_L00
  Top 0.152: IC1.100 52.42,67.51 34.29,67.51 R48.1
D_L01
  Top 0.152: IC1.99 52.92,67.84 36.83,67.84 R45.1
D_L02
  Top 0.152: IC1.98 53.42,68.17 39.37,68.17 R44.1
D_L03
  Top 0.152: IC1.97 53.92,68.5 41.91,68.5 R41.1
D_L04
  Top 0.152: IC1.96 54.42,68.83 44.45,68.83 R40.1
D_L05
  Top 0.152: IC1.95 54.92,69.16 46.99,69.16 R37.1
D_L06
  Top 0.152: IC1.92 56.42,69.49 49.53,69.49 R36.1
D_L07
  Top 0.152: IC1.91 56.92,69.83 52.07,69.83 R33.1
D_L08
  Top 0.152: IC1.89 57.92,70.16 54.61,70.16 R32.1
D_L09
  Top 0.152: IC1.87 58.92,70.48 57.15,70.48 R29.1
D_L10
  Top 0.152: IC1.86 59.42,71.27 R28.1
D_L11
  Top 0.152: IC1.85 59.92,70.48 62.23,70.48 R25.1
D_L12
  Top 0.152: IC1.84 60.42,70.16 60.42,70.18 64.77,70.18 R24.1
D_L13
  Top 0.152: IC1.83 60.92,69.88 67.31,69.88 R21.1
D_L14
  Top 0.152: IC1.82 61.42,69.57 69.85,69.57 R20.1
D_L15
  Top 0.152: IC1.81 61.92,69.27 66.14,69.27 66.45,69.27 72.39,69.27 R17.1
D_L16
  Top 0.152: IC1.78 63.42,68.96 74.93,68.96 R16.1
D_L17
  Top 0.152: IC1.77 63.92,68.66 77.47,68.66 R13.1
D_L18
  Top 0.152: IC1.76 64.42,68.35 80.01,68.35 R12.1
D_L19
  Top 0.152: IC1.75 66.15,61.88 66.14,61.87 67.97,61.87 67.97,67.97 82.55,67.97 R9.1
D_L20
  Top 0.152: IC1.74 68.28,61.38 68.28,67.67 85.09,67.67 R8.1
D_L21
  Top 0.152: IC1.73 68.58,60.88 68.58,67.36 87.63,67.36 R5.1
D_L22
  Top 0.152: IC1.72 68.89,60.38 68.89,67.06 90.17,67.06 R4.1
D_L23
  Top 0.152: IC1.71 69.19,59.88 69.19,66.75 92.71,66.75 R1.1
D_R00
  Top 0.152: IC1.26 52.43,47.24 50.29,47.24 50.29,43.97 34.29,43.97 R96.1
D_R01
  Top 0.152: IC1.27 52.92,46.94 50.6,46.94 50.6,43.66 36.88,43.66 36.88,40.22 R93.1
D_R02
  Top 0.152: IC1.28 53.42,46.63 50.9,46.63 50.9,43.36 39.62,43.36 39.62,40.22 R92.1
D_R03
  Top 0.152: IC1.29 53.92,46.33 51.21,46.33 51.21,43.05 42.06,43.05 42.06,40.22 R89.1
D_R04
  Top 0.152: R88.1 44.45,42.75 51.53,42.75 51.53,46.02 54.42,46.02 IC1.30
D_R05
  Top 0.152: IC1.33 55.92,42.44 46.99,42.44 R85.1
D_R06
  Top 0.152: IC1.34 56.42,42.14 49.53,42.14 R84.1
D_R07
  Top 0.152: IC1.35 56.92,41.83 52.07,41.83 R81.1
D_R08
  Top 0.152: IC1.36 57.42,41.53 54.61,41.53 R80.1
D_R09
  Top 0.152: IC1.38 58.42,41.22 57.15,41.22 R77.1
D_R10
  Top 0.152: IC1.40 59.42,40.22 R76.1
D_R11
  Top 0.152: IC1.41 59.92,41.22 62.23,41.22 R73.1
D_R12
  Top 0.152: IC1.42 60.42,41.53 64.77,41.53 R72.1
D_R13
  Top 0.152: IC1.43 60.92,41.83 67.31,41.83 R69.1
D_R14
  Top 0.152: R68.1 69.85,42.14 61.27,42.14 61.27,46.63 61.42,46.63 IC1.44
D_R15
  Top 0.152: IC1.47 62.92,42.44 72.39,42.44 R65.1
D_R16
  Top 0.152: IC1.48 63.42,42.75 74.93,42.75 R64.1
D_R17
  Top 0.152: IC1.49 63.9,43.05 77.47,43.05 R61.1
D_R18
  Top 0.152: IC1.50 64.42,43.36 80.01,43.36 R60.1
D_R19
  Top 0.152: IC1.51 67.97,49.88 67.97,43.66 82.55,43.66 R57.1
D_R20
  Top 0.152: IC1.52 68.28,50.38 68.28,43.97 85.09,43.97 R56.1
D_R21
  Top 0.152: IC1.53 68.58,50.88 68.58,44.27 87.63,44.27 R53.1
D_R22
  Top 0.152: IC1.54 68.89,51.38 68.89,44.58 90.17,44.58 R52.1
D_R23
  Top 0.152: IC1.55 69.19,51.88 69.19,44.88 92.71,44.88 R49.1
ETH_R+
  Bottom 0.254: J7.3 44.45,16.19 80.96,16.19 80.96,24.77 85.09,24.77 85.09,20.95 86.36,20.95 J5.RD+
ETH_R-
  Bottom 0.254: J7.4 41.91,15.56 81.6,15.56 81.6,23.5 J5.RD-
ETH_T+
  Bottom 0.254: J7.5 39.37,26.67 37.47,26.67 37.47,14.92 82.23,14.92 82.23,19.68 85.09,19.68 85.09,17.14 J5.TD+
ETH_T-
  Bottom 0.254: J7.6 36.83,14.29 83.82,14.29 J5.TD-
GND  (via drill 0.3, 0.6)
  Top 0.152: J5.Y- J5.G- | C24.2 16.51,57.15 v16.51,58.44 | v16.51,58.44 16.51,62.26 17.36,62.26 C23.2 | v16.51,58.44 21.59,58.44 | 21.59,58.44 22.69,58.44 OS1.2 | OS2.2 21.59,55.08 21.59,58.44 | J4.2 25.4,34.14 25.6,34.14 | IC1.11 52.73,56.88 v52.73,56.62 | IC1.65 v68.28,56.88 v68.28,56.87 | L5.2 67.73,28.35 78.64,28.35 78.64,28.69 C21.2
  Top 0.254: L5.2 C18.2 | v80.77,46.63 73.52,46.63 R110.2 | v80.77,65.23 78.55,65.23 | 78.55,65.23 73.55,65.23 R111.2 | C15.2 78.55,65.23
  Top 0.406: C21.2 83.82,30.06 83.82,29.57 83.82,29.53 | 83.82,29.53 J5.GND | v89.79,29.53 83.82,29.53
  Top 0.61: C15.2 C16.2
  Top 1.016: 24.13,30.79 25.6,30.79 25.6,34.14 29.74,34.14 R99.2 29.74,45.36 | 24.08,30.79 24.13,30.79 | 24.13,30.79 J7.11 24.13,25.6 55.78,25.6 57.3,27.13 62.18,27.13 64.73,29.68 C18.2 | C22.2 82.31,13.12 | 82.31,13.12 IC2.1 | 82.31,13.12 89.79,13.12 J5.SHIELD1
  Bottom 0.152: J5.G- 95.25,17.53 95.25,29.53 | v16.51,58.44 10.36,58.44 10.36,63.5 J8.1 | v52.73,56.62 52.73,52.73
  Bottom 0.254: v68.28,56.88 80.77,56.88 | 80.77,56.88 v80.77,46.63 | 80.77,56.88 v80.77,65.23
  Bottom 0.406: 95.25,29.53 v89.79,29.53 J5.SHIELD0 | 95.25,17.53 89.61,17.53 89.61,13.12 89.79,13.12 89.79,12.8
  Bottom 1.016: 25.4,33.66 J4.2 25.4,32.07 15.24,32.07 J4.10 7.62,34.29 7.62,45.72 J6.1 2.54,45.72 2.54,63.5 J8.1 5.08,68.58 12.85,68.58 J9.16 | CN1.GND 95.52,9.88 CN1.GNDBREAK 90.17,9.88 90.17,10.16 89.79,10.16 89.79,12.8 J5.SHIELD1 88.27,13.59 88.27,13.65 87.95,13.65 87.95,9.53 11.6,9.53 USB-A.4 | C20.- C18.2 64.73,34.14 41.76,34.14 41.76,52.73 52.73,52.73 68.28,52.73 v68.28,56.87
I2S_BCLK
  Top 0.152: IC1.14 48.98,55.38 48.98,53.42 7.01,53.42 | 7.01,53.42 7.01,55.88 J8.4 | 7.01,53.42 7.01,31.09 11.43,31.09 J7.16
I2S_DATA  (via drill 0.3)
  Top 0.152: J7.18 3.81,27.94 3.81,53.34 J8.5 | IC1.16 49.61,54.38 49.61,52.81 14.5,52.81 14.5,51.51 14.43,51.51 | v9.75,51.51 14.43,51.51 | 14.43,51.51 14.45,51.54
  Bottom 0.152: v9.75,51.51 6.91,51.51 J8.5
I2S_LRCLK  (via drill 0.3)
  Top 0.152: J7.15 13.97,26.52 3.35,26.52 3.35,58.42 J8.3 | IC1.15 49.3,54.88 49.3,53.11 8.23,53.11 v8.23,52.43
  Bottom 0.152: v8.23,52.43 8.23,58.42 J8.3
I2S_MCLK  (1 unrouted)
  Top 0.152: IC1.12 48.16,56.39 48.16,54.86 39.93,54.86 39.93,55.78 28.04,55.78 28.04,54.92 26.88,54.92 26.82,54.86 | J8.2 11.58,60.96 11.58,54.03 26.91,54.03 R103.2 R102.2
MCLK1_CTL
  Top 0.152: J7.21 44.45,2.54 2.22,2.54 2.22,66.04 12.19,66.04 12.19,61.57 14.63,61.57 14.63,59.74 15.66,59.74 R104.2
MCLK2_CTL
  Top 0.152: J7.22 41.91,2.86 2.54,2.86 2.54,65.72 11.89,65.72 11.89,54.33 15.66,54.33 R105.2
N$1
  Top 0.152: R7.1 83.82,77.05 83.82,75.35 R10.2 R9.2
N$2
  Top 0.152: R2.1 91.44,77.05 91.44,75.35 R3.2 R4.2
N$3
  Top 0.152: R3.1 88.9,77.05 88.9,75.35 R6.2 R5.2
N$4
  Top 0.152: R6.1 86.36,77.05 86.36,75.35 R7.2 R8.2
N$5
  Top 0.152: C2.2 97.79,77.47 C1.2 97.79,71.12 R100.1
N$6
  Top 0.152: R10.1 81.28,77.05 81.28,75.35 R11.2 R12.2
N$7
  Top 0.152: R11.1 78.74,77.05 78.74,75.35 R14.2 R13.2
N$8
  Top 0.152: R14.1 76.2,77.05 76.2,75.35 R15.2 R16.2
N$9
  Top 0.152: R15.1 73.66,77.05 73.66,75.35 R18.2 R17.2
N$10
  Top 0.152: R31.1 53.34,77.05 53.34,75.35 R34.2 R33.2
N$11
  Top 0.152: R81.2 R82.2 53.34,36.41 53.34,34.71 R79.1
N$12
  Top 0.152: R65.2 R66.2 73.66,36.41 73.66,34.71 R63.1
N$13  (via drill 0.3)
  Top 0.254: IC1.39 58.92,49.68 v58.93,50.88 | v70.51,50.88 71.82,50.9 R108.1
  Bottom 0.254: v58.93,50.88 v70.51,50.88
N$14
  Top 0.152: R18.1 71.12,77.05 71.12,75.35 R19.2 R20.2
N$15
  Top 0.152: R19.1 68.58,77.05 68.58,75.35 R22.2 R21.2
N$16
  Top 0.152: L2.2 13.65,57.15 C24.1 15.66,56.19 19.79,56.19 19.79,56.21 20.22,56.21 20.22,56.68 OS2.4
N$17
  Top 0.152: R46.1 35.56,77.05 35.56,75.35 R47.2 R48.2
N$18
  Top 0.152: R43.1 38.1,77.05 38.1,75.35 R46.2 R45.2
N$19
  Top 0.152: R34.1 50.8,77.05 50.8,75.35 R35.2 R36.2
N$20
  Top 0.152: R35.1 48.26,77.05 48.26,75.35 R38.2 R37.2
N$21
  Top 0.152: R38.1 45.72,77.05 45.72,75.35 R39.2 R40.2
N$22
  Top 0.152: R39.1 43.18,77.05 43.18,75.35 R42.2 R41.2
N$23
  Top 0.152: R42.1 40.64,77.05 40.64,75.35 R43.2 R44.2
N$24
  Top 0.152: R68.2 R67.2 71.12,36.41 71.12,34.71 R66.1
N$25
  Top 0.152: R69.2 R70.2 68.58,36.41 68.58,34.71 R67.1
N$26
  Top 0.152: R72.2 R71.2 66.04,36.41 66.04,34.71 R70.1
N$27
  Top 0.152: R73.2 R74.2 63.5,36.41 63.5,34.71 R71.1
N$28
  Top 0.152: R76.2 R75.2 60.96,36.41 60.96,34.71 R74.1
N$29
  Top 0.152: R77.2 R78.2 58.42,36.41 58.42,34.71 R75.1
N$30
  Top 0.152: R80.2 R79.2 55.88,36.41 55.88,34.71 R78.1
N$31
  Top 0.152: R84.2 R83.2 50.8,36.41 50.8,34.71 R82.1
N$32
  Top 0.152: R85.2 R86.2 48.26,36.41 48.26,34.71 R83.1
N$33
  Top 0.152: R88.2 R87.2 45.72,36.41 45.72,34.71 R86.1
N$34
  Top 0.152: R89.2 R90.2 43.18,36.41 43.18,34.71 R87.1
N$35
  Top 0.152: R92.2 R91.2 40.64,36.41 40.64,34.71 R90.1
N$36
  Top 0.152: R93.2 R94.2 38.1,36.41 38.1,34.71 R91.1
N$37
  Top 0.152: R96.2 R95.2 35.56,36.41 35.56,34.71 R94.1
N$38
  Top 0.152: 97.92,36.83 C12.2 | C11.2 97.92,36.83 | 97.92,36.83 R101.1
N$39
  Top 0.152: OS2.3 24.08,56.68 24.08,54.86 R103.1
N$40
  Top 0.152: R22.1 66.04,77.05 66.04,75.35 R23.2 R24.2
N$41
  Top 0.152: R23.1 63.5,77.05 63.5,75.35 R26.2 R25.2
N$42
  Top 0.152: R26.1 60.96,77.05 60.96,75.35 R27.2 R28.2
N$43
  Top 0.152: R27.1 58.42,77.05 58.42,75.35 R30.2 R29.2
N$44
  Top 0.152: R30.1 55.88,77.05 55.88,75.35 R31.2 R32.2
N$45
  Top 0.152: R52.2 R51.2 91.44,36.41 91.44,34.71 R50.1
N$46
  Top 0.152: R53.2 R54.2 88.9,36.41 88.9,34.71 R51.1
N$47
  Top 0.152: R56.2 R55.2 86.36,36.41 86.36,34.71 R54.1
N$48
  Top 0.152: OS1.3 25.21,61.76 R102.1
N$49
  Top 0.152: R57.2 R58.2 83.82,36.41 83.82,34.71 R55.1
N$50
  Top 0.152: R60.2 R59.2 81.28,36.41 81.28,34.71 R58.1
N$51
  Top 0.152: R61.2 R62.2 78.74,36.41 78.74,34.71 R59.1
N$52
  Top 0.152: R64.2 R63.2 76.2,36.41 76.2,34.71 R62.1
N$53  (via drill 0.3)
  Top 0.254: IC1.88 58.42,60.96 v58.83,60.96 | v71.63,60.96 71.63,63.86 R109.1
  Bottom 0.254: v58.83,60.96 v71.63,60.96
N$55
  Top 0.152: R104.1 20.49,59.69 OS1.1
N$56
  Top 0.152: OS2.1 17.36,55.08 R105.1
N$57
  Top 0.152: L1.2 13.65,62.23 C23.1 15.85,62.23 | 20.49,61.28 OS1.4 20.49,63.4 15.85,63.4 15.85,62.23 | 15.88,62.23 15.85,62.23
N$58
  Top 0.152: J5.G+ 97.79,14.99 97.79,12.7 98,12.7 R107.2
N$59  (via drill 0.3)
  Top 0.254: IC1.37 57.92,50.6 v57.91,51.51 | v72.24,51.51 69.8,51.51 69.8,46.63 71.82,46.63 R110.1
  Bottom 0.254: v57.91,51.51 v72.24,51.51
N$60
  Top 0.152: J5.Y+ 97.79,28.19 97.79,30.48 98,30.48 R106.2
N$61  (via drill 0.3)
  Top 0.254: IC1.90 57.42,61.87 v57.61,61.87 | v70.41,61.87 70.41,65.38 R111.1
  Bottom 0.254: v57.61,61.87 v70.41,61.87
N$67
  Top 0.152: C22.1 80.01,19.05 81.92,20.95 J5.P4
N$68
  Top 0.152: C21.1 80.01,24.13 81.92,22.23 J5.P5
N$98  (via drill 0.6)
  other vias: 93.98,48.26
R2R_AC_L
  Top 0.152: R100.2 93.88,71.12 93.88,66.45 95.25,66.45 C9.1 | 95.25,66.67 C9.1 | C10.1 97.79,66.46 C9.1 | 95.25,66.04 C9.1
  Bottom 0.152: C10.1 97.79,62.23 93.98,62.23 93.98,52.07 88.63,52.07 J3.TIP
R2R_AC_R
  Top 0.152: C14.1 97.79,45.72 95.25,45.72 C13.1 95.25,45.09 93.98,45.09 93.98,40.64 R101.2
  Bottom 0.152: C14.1 95.25,48.22 95.25,58.42 96.03,58.42 J3.RING
R2R_DC_L
  Top 0.152: R1.2 R2.2 92.71,74.93 C1.1 95.12,74.93 C2.1
R2R_DC_R
  Top 0.152: R49.2 R50.2 95.25,36.41 | 95.25,36.41 95.25,36.2 95.12,36.2 C12.1 | 95.25,36.41 C11.1
RAW_01
  Top 0.152: J9.1 32.31,76.2 32.31,62.18 47.85,62.18 47.85,61.38 IC1.2
RAW_02
  Top 0.152: J9.2 32,73.66 32,61.87 47.55,61.87 47.55,60.88 IC1.3
RAW_03
  Top 0.152: J9.3 29.26,76.2 29.26,72.24 31.7,72.24 31.7,61.57 47.24,61.57 47.24,60.38 IC1.4
RAW_04
  Top 0.152: J9.4 28.04,73.66 28.04,71.93 31.39,71.93 31.39,61.27 46.94,61.27 46.94,59.88 IC1.5
RAW_05
  Top 0.152: J9.5 26.82,76.2 26.82,71.63 31.09,71.63 31.09,60.96 46.63,60.96 46.63,59.38 IC1.6
  Top 0.254: IC1.6
RAW_06
  Top 0.152: J9.6 25.6,73.58 25.6,71.32 30.79,71.32 30.79,60.66 46.33,60.66 46.33,58.88 IC1.7
RAW_07  (via drill 0.3)
  Top 0.152: J9.7 24.31,76.12 24.31,71.02 30.48,71.02 30.48,60.35 45.41,60.35 v45.41,60.05 | IC1.69 63.4,58.88 v63.4,59.74
  Bottom 0.152: v45.41,60.05 45.72,59.74 v63.4,59.74
RAW_08  (via drill 0.3)
  Top 0.152: J9.8 23.16,73.58 23.16,70.71 30.18,70.71 30.18,60.05 44.2,60.05 v44.2,59.44 | IC1.68 62.79,58.38 v62.79,59.03
  Bottom 0.152: v44.2,59.44 62.79,59.44 v62.79,59.03
RAW_09  (via drill 0.3)
  Top 0.152: J9.9 21.77,76.12 21.77,70.41 29.87,70.41 29.87,59.74 42.98,59.74 v42.98,59.44 | IC1.67 62.18,57.88 v62.18,58.32
  Bottom 0.152: v42.98,59.44 42.98,58.83 44.81,58.83 45.11,59.13 62.18,59.13 v62.18,58.32
RAW_10  (via drill 0.3)
  Top 0.152: J9.10 20.42,73.58 20.42,70.1 29.57,70.1 29.57,59.44 41.76,59.44 v41.76,58.83 | IC1.66 61.57,57.38 v61.57,57.61
  Bottom 0.152: v41.76,58.83 42.06,58.52 45.11,58.52 45.41,58.83 61.57,58.83 v61.57,57.61
RAW_11  (via drill 0.3)
  Top 0.152: J9.11 19.13,76.12 19.2,76.2 19.2,69.8 29.26,69.8 29.26,59.13 40.54,59.13 v40.54,58.83 | 60.96,56.58 v60.96,56.9 60.96,56.38 IC1.64
  Bottom 0.152: v40.54,58.83 40.54,58.22 45.41,58.22 45.72,58.52 60.96,58.52 v60.96,56.9
RAW_12  (via drill 0.3)
  Top 0.152: J9.12 17.93,69.49 28.96,69.49 28.96,58.83 39.32,58.83 v39.32,58.22 | IC1.62 60.35,55.38 v60.35,54.76
  Bottom 0.152: v39.32,58.22 39.62,57.91 45.72,57.91 46.02,58.22 60.35,58.22 v60.35,54.76
RAW_13  (via drill 0.3)
  Top 0.152: J9.13 16.76,76.2 16.76,69.19 28.65,69.19 28.65,58.52 38.1,58.52 v38.1,58.22 | IC1.61 61.57,54.88 61.57,53.95 59.74,53.95 v59.74,54.05
  Bottom 0.152: v38.1,58.22 38.1,57.91 38.41,57.61 46.02,57.61 46.33,57.91 59.74,57.91 v59.74,54.05
RAW_14  (via drill 0.3)
  Top 0.152: J9.14 15.39,68.89 28.35,68.89 28.35,58.22 36.88,58.22 v36.88,57.61 | IC1.58 59.13,53.38 v59.13,54.76
  Bottom 0.152: v36.88,57.61 37.19,57.3 46.33,57.3 46.63,57.61 59.13,57.61 v59.13,54.76
RAW_15  (via drill 0.3)
  Top 0.152: J9.15 12.85,76.2 14.02,76.2 14.02,68.58 28.04,68.58 28.04,57.91 35.66,57.91 v35.66,57.61 | IC1.57 58.52,52.88 v58.52,54.05
  Bottom 0.152: v35.66,57.61 35.66,57.3 35.97,57 46.63,57 46.94,57.3 58.52,57.3 v58.52,54.05
TCK
  Top 0.152: IC1.24 49,50.38 49,51.74 15.46,51.74 15.46,38.41 21.59,38.41 21.59,35.51 25.43,35.51 25.43,35.87 25.4,35.87 J4.1 25.4,40.96 R99.1
TDI
  Top 0.152: IC1.23 49.3,50.85 49.3,52.05 15.15,52.05 15.15,40.96 R98.2 12.6,36.83 J4.9
TDO
  Top 0.152: IC1.25 48.67,49.88 48.67,51.44 15.77,51.44 15.77,39.55 22.86,39.55 J4.3
TMS
  Top 0.152: IC1.22 49.68,51.38 49.68,52.43 14.83,52.43 14.83,42.55 R97.2 11.79,42.55 11.79,35.66 20.32,35.66 J4.5
TP_1
  Top 0.152: TP1.TP R106.1
TP_2
  Top 0.152: R107.1 96.31,10.79 97.79,10.79 TP2.TP
UART_RX
  Bottom 0.152: J6.3 3.49,40.64 3.49,29.21 26.67,29.21 J7.10
UART_TX
  Bottom 0.152: J6.4 5.08,29.84 29.21,29.84 J7.9
USB_D+
  Bottom 0.152: USB-A.3 33.29,15.51 34.29,16.51 J7.7
USB_D-
  Bottom 0.152: USB-A.2 30.21,17.51 31.75,19.05 J7.8
VCC  (via drill 0.3)
  Top 0.152: J4.4 22.86,32.38 11.11,32.38 11.11,40.64 11.43,40.64 11.43,40.96 R98.1 | R98.1 10.79,40.96 | R98.1 R97.1 10.36,42.55 v10.36,48.64 | IC1.13 48.67,55.88 48.67,53.72 37.49,53.72 | 37.49,53.72 10.36,53.72 v10.36,55.17 | v12.8,55.17 12.8,59.74 13.64,59.74 | 13.64,59.74 L1.1 | 13.64,59.74 13.64,58.65 L2.1 | v36.58,54.86 37.49,54.86 37.49,53.72
  Top 0.254: IC1.13 IC1.63 73.52,55.88 73.52,59.12 | R109.2 73.52,63.86 73.52,62.38 | 73.52,62.38 73.52,59.12 | C15.1 73.52,62.38 | 73.52,59.12 79.86,59.12 79.86,48.46 73.52,48.46 R108.2
  Top 0.61: C15.1 C16.1
  Bottom 0.152: v10.36,48.64 10.36,48.36 | v10.36,48.64 v10.36,55.17 v12.8,55.17 | v10.36,48.64 7.24,48.64 J8.6
  Bottom 1.016: L4.P$2 arc-90 59.73,24.09 C20.+ C18.1 36.58,30.48 v36.58,54.86
VCCIO  (via drill 0.3)
  Top 0.152: IC1.31 54.92,45.05 C4.1 arc90 53.99,45.11 v53.03,45.11 | 46.48,57.88 C3.1 | IC1.45 61.92,49.99 | 61.92,49.99 61.92,52.12 54.92,52.12 | v61.87,45.11 arc90 61.92,45.16 61.92,48.16 | 61.92,49.99 v60.96,49.99
  Top 0.254: C3.1 46.35,57.88 IC1.9 55.42,57.88 | IC1.31 54.92,52.12 v54.92,53.92 v54.91,53.92 | v54.89,56.59 55.42,56.39 55.42,57.88 | 55.42,57.88 55.42,60.05 | 55.42,60.05 IC1.94 | IC1.80 62.42,60.05 55.42,60.05 | IC1.59 76.85,53.88 76.85,53.95
  Top 0.61: C6.1 C8.1 76.85,53.95 C7.1 C5.1
  Top 1.016: v74.98,50.9 74.98,51.1 C5.1
  Bottom 0.152: v53.03,45.11 v61.87,45.11 | v60.96,49.99 60.96,49.07 74.98,49.07
  Bottom 0.254: v54.91,53.92 54.91,56.39 v54.89,56.59
  Bottom 1.016: C17.1 77.47,30.48 | C17.1 C19.+ 77.43,24.09 arc-90 L3.P$2 | C17.1 77.43,47.24 74.98,47.24 74.98,49.07 v74.98,50.9